# EAGLE design gestureBoard (EAGLE 9.2.2)
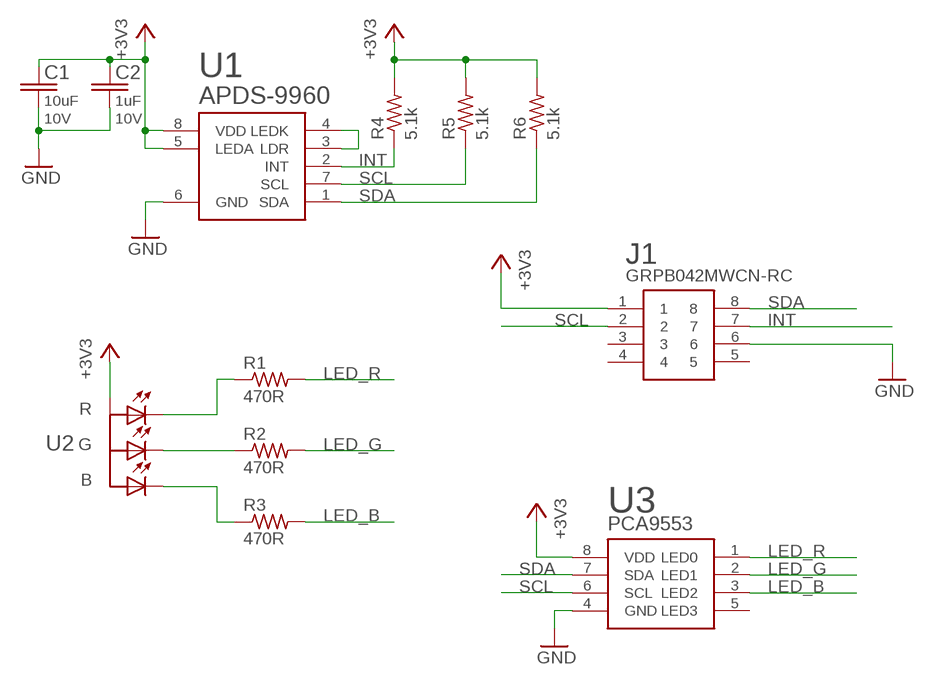
[diagram p0: schematic, sheet 1]

## Parts
C1  10uF  GRM188R61A106KE69D  [C0603]
C2  1uF  CL05A105MP5NNNC  [C0402]
J1  GRPB042MWCN-RC  [GRPB042MWCN-RC]
R1  470R  RC0402JR-07470RL  [R0402]
R2  470R  RC0402JR-07470RL  [R0402]
R3  470R  RC0402JR-07470RL  [R0402]
R4  5.1k  RC0402JR-075K1L  [R0402]
R5  5.1k  RC0402JR-075K1L  [R0402]
R6  5.1k  RC0402JR-075K1L  [R0402]
U1  APDS-9960  [APDS-9960]
U2  ASMB-MTB0-0A3A2  [ASMB-MTB0_LED]
U3  PCA9553TSSOP8  [SOP65P490X110-8]

## Nets
+3V3: C1.1 C2.1 J1.1 R4.2 R5.2 R6.2 U1.5(LEDA) U1.8(VDD) U2.1(A) U3.8(VDD)
GND: C1.2 C2.2 J1.6 U1.6(GND) U3.4(GND)
INT: J1.7 R4.1 U1.2(INT)
LED_B: R3.2 U3.3(LED2)
LED_G: R2.2 U3.2(LED1)
LED_R: R1.2 U3.1(LED0)
N$1: R1.1 U2.4(R)
N$2: R2.1 U2.3(G)
N$3: R3.1 U2.2(B)
N$4: U1.3(LDR) U1.4(LEDK)
SCL: J1.2 R5.1 U1.7(SCL) U3.6(SCL)
SDA: J1.8 R6.1 U1.1(SDA) U3.7(SDA)
Unconnected: J1.3 J1.4 J1.5 U3.5(LED3)

## Library data of the parts
C1 = thanics-capacitor:GRM188R61A106KE69D; RATING: 10V
C2 = thanics-capacitor:CL05A105MP5NNNC; RATING: 10V
J1 = thanics-connector:GRPB042MWCN-RC
R1-R3 = thanics-resistor:RC0402JR-07470RL; TOL: 5%
R4-R6 = thanics-resistor:RC0402JR-075K1L; TOL: 5%
U1 = glasses:APDS-9960
U2 = glasses:ASMB-MTB0-0A3A2
U3 = glasses:PCA9553

## Board
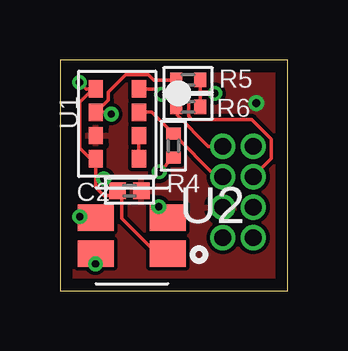
[diagram p1: board, top side]
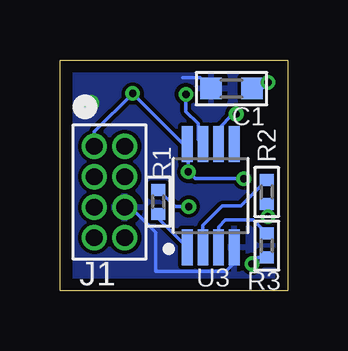
[diagram p2: board, bottom side, seen from below]

Size 9.48 x 9.63 mm. Coordinates in mm from the lower left corner, seen from the top.
Outline: 0,0 9.48,0 9.48,9.63 0,9.63 0,0
Copper layers (1*16): Top 0.035mm / dielectric 1.6mm / Bottom 0.035mm
Design rules "Elecrow_2-layer_PCB_eagle_rule": minimum track width 6mil, minimum drill 12mil, track to track 6mil, track to pad 6mil, pad to pad 6mil, via to via 8mil, smd to smd 0mil, copper to edge 20mil, drill to drill 10mil, minimum pad ring 6mil, minimum via ring 6mil, stop-mask expansion 0mil, vias tented up to drill 100mil, thermal gap 10mil

### Footprints (pad centres in the part's own frame; a part is rotated, then mirrored left to right if it is on the bottom)
C0603 = smd 0.9 x 0.9: 1 -0.85,0; 2 0.85,0
C0402 = smd 0.7 x 0.7: 1 -0.5,0; 2 0.5,0
GRPB042MWCN-RC = drill 0.7 pad 0.991: 1 -1.905,-0.635; 2 -0.635,-0.635; 3 0.635,-0.635; 4 1.905,-0.635; 5 1.905,0.635; 6 0.635,0.635; 7 -0.635,0.635; 8 -1.905,0.635
R0402 = smd 0.5 x 0.6: 1 -0.5,0; 2 0.5,0
APDS-9960 = smd 0.6 x 0.72: 1 0.9,1.455; 2 0.9,0.485; 3 0.9,-0.485; 4 0.9,-1.455; 5 -0.9,-1.455; 6 -0.9,-0.485; 7 -0.9,0.485; 8 -0.9,1.455
ASMB-MTB0_LED = smd 1.1 x 1.5: 1 -0.75,-1.5; 2 -0.75,1.5; 3 0.75,1.5; 4 0.75,-1.5
SOP65P490X110-8 = smd 1.5 x 0.45: 1 -2.153,0.975; 2 -2.153,0.325; 3 -2.153,-0.325; 4 -2.153,-0.975; 5 2.153,-0.975; 6 2.153,-0.325; 7 2.153,0.325; 8 2.153,0.975

### Placement (x,y rotation side)
C1  2.34,8.43 180 bottom
C2  2.9,4.17 0 top
J1  7.42,4.11 270 bottom
R1  5.38,3.71 270 bottom
R2  0.86,4.11 90 bottom
R3  0.86,1.88 90 bottom
R4  4.72,6.05 270 top
R5  5.33,8.79 0 top
R6  5.33,7.67 0 top
U1  2.39,6.96 0 top
U2  3,2.29 90 top
U3  3.2,3.96 90 bottom

### Tracks (layer width: path | path; a pad name or v marks a point on that pad's centre or on a via)
+3V3  (via drill 0.3)
  Top 0.152: 1.49,4.57 U1.5 1.25,5.5 0.81,5.94 0.81,7.86 1.37,8.41 U1.8 1.08,8.41 v0.81,8.69 | 1.49,4.57 1.49,4.31 1.88,3.92 1.88,3.97 2.2,3.97 C2.1 | R4.2 v4.14,4.96 4.09,4.92 | R5.2 5.76,8.88 5.83,8.81 5.83,8.28 | R6.2 5.83,8.28 | v6.45,8.23 6.4,8.28 5.83,8.28 | 4.98,1.42 4.87,1.54 U2.1 4.05,1.54 2.56,3.02 2.56,4 C2.1 | 2.4,4.42 C2.1 | 1.49,4.57 1.72,4.57 v1.82,4.67
  Bottom 0.152: J1.1 8.05,6.63 v6.45,8.23 4.34,6.12 | 4.34,6.12 4.14,5.91 v4.14,4.96 3.85,4.67 v1.82,4.67 | U3.8 4.34,6.12 | v0.81,8.69 1.07,8.43 C1.1
GND  (via drill 0.35)
  Bottom 0.152: J1.6 6.53,3.48 5.78,2.73 5.49,2.44 5.49,0.81 2.57,0.81 2.23,1.16 U3.4 | C1.2 3.64,8.89 4.37,8.89
  other vias: 8.18,7.82
  pour Bottom: 0,12.09 10.21,12.09 10.21,-1.83 0,-1.83
  pour Top: -0.05,11.94 10.16,11.94 10.16,-1.93 -0.05,-1.93
INT
  Top 0.152: U1.2 3.83,7.44 R4.1 6.52,4.75 J1.7
LED_B
  Bottom 0.152: U3.3 2.88,2.66 2.59,2.95 1.43,2.95 R3.2
LED_G
  Bottom 0.152: U3.2 3.52,2.72 2.72,3.53 1.95,3.53 R2.2
LED_R
  Bottom 0.152: U3.1 5.38,3.02 R1.2
N$1  (via drill 0.3)
  Top 0.152: v4.12,3.5 4.12,3.42 U2.4
  Bottom 0.152: R1.1 4.68,3.5 v4.12,3.5
N$2  (via drill 0.3)
  Top 0.152: v0.82,3.09 0.88,3.04 U2.3
  Bottom 0.152: R2.1 0.86,3.13 v0.82,3.09
N$3  (via drill 0.3)
  Top 0.152: v1.47,1.12 1.5,1.14 U2.2
  Bottom 0.152: R3.1 1.21,1.38 v1.47,1.12
N$4
  Top 0.152: U1.3 U1.4
SCL  (via drill 0.3)
  Top 0.152: U1.7 | U1.7 2.06,7.44 v2.13,7.37 | U1.7 2.02,7.96 2.02,8.28 2.74,9 3.68,9 3.9,8.79 R5.1 5.36,8.27 5.36,7.28 5.49,7.14 8,7.14 8.8,6.33 8.8,5.5 J1.2
  Bottom 0.152: U3.6 2.88,6.76 2.27,7.37 v2.13,7.37
SDA  (via drill 0.3)
  Top 0.152: 4.09,8.41 R6.1 4.88,7.62 4.88,7.32 6.18,6.02 J1.8 | 4.09,8.41 U1.1 | v4.23,8.19 4.09,8.34 4.09,8.41
  Bottom 0.152: U3.7 3.72,6.31 3.72,6.96 4.23,7.47 v4.23,8.19